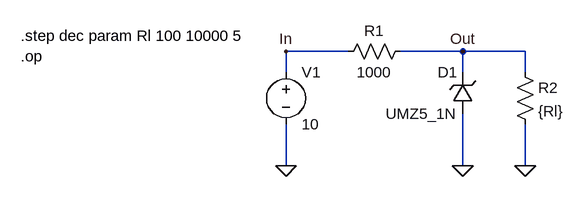
[diagram p0: schematic zener_regulator.asc]
zener_regulator.asc, the LTspice schematic file:
Version 4
SHEET 1 880 680
WIRE 272 128 176 128
WIRE 448 128 352 128
WIRE 544 128 448 128
WIRE 176 160 176 128
WIRE 448 160 448 128
WIRE 544 160 544 128
WIRE 176 304 176 240
WIRE 448 304 448 224
WIRE 544 304 544 240
FLAG 176 304 0
FLAG 448 304 0
FLAG 448 128 Out
FLAG 176 128 In
FLAG 544 304 0
SYMBOL voltage 176 144 R0
SYMATTR InstName V1
SYMATTR Value 10
SYMBOL res 368 112 R90
WINDOW 0 0 56 VBottom 2
WINDOW 3 32 56 VTop 2
SYMATTR InstName R1
SYMATTR Value 1000
SYMBOL zener 464 224 R180
WINDOW 0 24 64 Left 2
WINDOW 3 24 0 Left 2
SYMATTR InstName D1
SYMATTR Value UMZ5_1N
SYMBOL res 528 144 R0
SYMATTR InstName R2
SYMATTR Value {Rl}
TEXT -232 104 Left 2 !.step dec param Rl 100 10000 5\n.op

The netlist it stands for:
* zener_regulator.asc
V1 In 0 10
R1 Out In 1000
D1 0 Out UMZ5_1N
R2 Out 0 {Rl}
.model D D
.lib standard.dio
.step dec param Rl 100 10000 5
.op
.backanno
.end